# EAGLE design preamp (EAGLE 6.1)
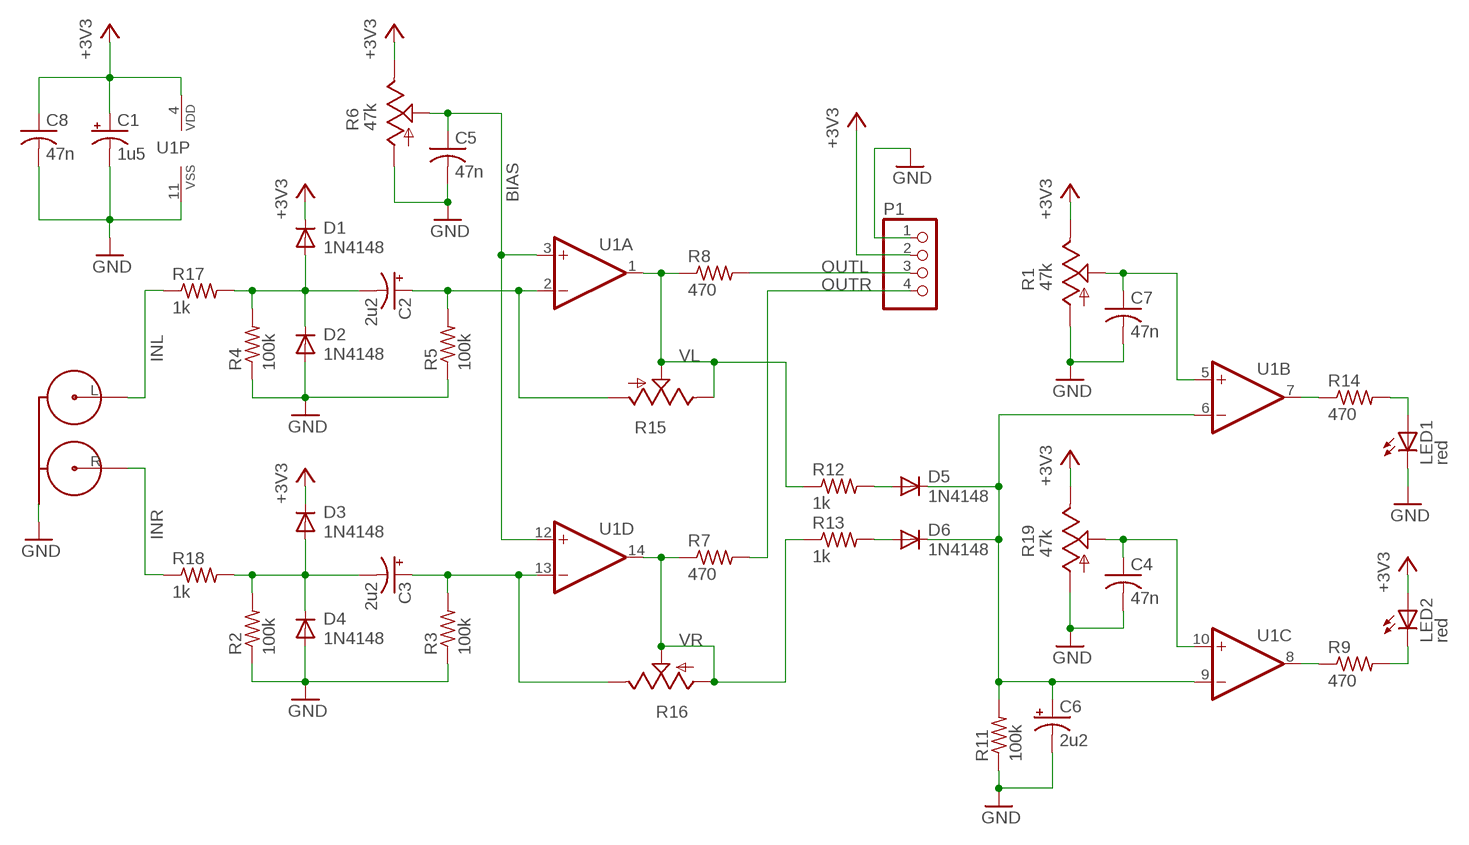
[diagram p0: schematic, sheet 1]

## Parts
C1  1u5  CPOL-USE2-4  [E2-4]
C2  2u2  CPOL-USE2.5-5  [E2,5-5]
C3  2u2  CPOL-USE2.5-5  [E2,5-5]
C4  47n  C-US050-025X075  [C050-025X075]
C5  47n  C-US050-025X075  [C050-025X075]
C6  2u2  CPOL-USE2.5-6  [E2,5-6]
C7  47n  C-US050-025X075  [C050-025X075]
C8  47n  C-US050-025X075  [C050-025X075]
D1  1N4148  [DO35-5]
D2  1N4148  [DO35-5]
D3  1N4148  [DO35-5]
D4  1N4148  [DO35-5]
D5  1N4148  [DO35-5]
D6  1N4148  [DO35-5]
LED1  red  LED3MM  [LED3MM]
LED2  red  LED3MM  [LED3MM]
P1  PINHD-1X4  [1X04]
R1  47k  TRIM_US-PT-10S  [PT-10S]
R2  100k  R-US_0204/5  [0204/5]
R3  100k  R-US_0204/5  [0204/5]
R4  100k  R-US_0204/5  [0204/5]
R5  100k  R-US_0204/5  [0204/5]
R6  47k  TRIM_US-PT-10S  [PT-10S]
R7  470  R-US_0204/5  [0204/5]
R8  470  R-US_0204/5  [0204/5]
R9  470  R-US_0204/5  [0204/5]
R11  100k  R-US_0204/5  [0204/5]
R12  1k  R-US_0204/5  [0204/5]
R13  1k  R-US_0204/5  [0204/5]
R14  470  R-US_0204/5  [0204/5]
R15  TRIM_US-S63S  [S63S]
R16  TRIM_US-S63S  [S63S]
R17  1k  R-US_0204/5  [0204/5]
R18  1k  R-US_0204/5  [0204/5]
R19  47k  TRIM_US-PT-10S  [PT-10S]
RCA1  RCA-2V  [RCA-2V]
U1  MCP6024-I/P  [DIL14]

## Nets
+3V3: C1.+ C8.1 D1.C D3.C LED2.A P1.2 R1.E R6.E R19.E U1.4(P:VDD)
BIAS: C5.1 R6.S U1.3(A:+IN) U1.12(D:+IN)
GND: C1.- C4.2 C5.2 C6.- C7.2 C8.2 D2.A D4.A LED1.K(C) P1.1 R1.A R2.1 R3.1 R4.1 R5.1 R6.A R11.1 R19.A RCA1.SHIELD U1.11(P:VSS)
INL: R17.1 RCA1.L
INR: R18.1 RCA1.R
N$1: C4.1 R19.S U1.10(C:+IN)
N$2: R9.1 U1.8(C:OUT)
N$3: C3.- D3.A D4.C R2.2 R18.2
N$4: C6.+ D5.C D6.C R11.2 U1.6(B:-IN) U1.9(C:-IN)
N$5: C2.+ R5.2 R15.A U1.2(A:-IN)
N$6: C7.1 R1.S U1.5(B:+IN)
N$7: LED1.A R14.2
N$8: C2.- D1.A D2.C R4.2 R17.2
N$9: C3.+ R3.2 R16.E U1.13(D:-IN)
N$10: D5.A R12.2
N$11: D6.A R13.2
N$12: LED2.K(C) R9.2
N$13: R14.1 U1.7(B:OUT)
OUTL: P1.3 R8.2
OUTR: P1.4 R7.2
VL: R8.1 R12.1 R15.E R15.S U1.1(A:OUT)
VR: R7.1 R13.1 R16.A R16.S U1.14(D:OUT)

## Library data of the parts
C1-C3 C6 = rcl:CPOL-US: POLARIZED CAPACITOR, American symbol
C4 C5 C7 C8 = rcl:C-US: CAPACITOR, American symbol
D1-D6 = diode_local:1N4148
LED1 LED2 = led:LED: LED OSRAM: - CHIPLED LG R971, LG N971, LY N971, LG Q971, LY Q971, LO R971, LY R971 LH N974, LH R974 LS Q976, LO Q976, LY Q976 LO Q996 - Hyper CHIPLED LW Q18S LB Q993, LB Q99A, LB R99A - SideLED LS A670, LO A670, LY A670, LG A670, LP A670 LB A673, LV A673, LT A673, LW A673 LH A674 LY A675 LS A676, LA A676, LO A676, LY A676, LW A676 LS A679, LY A679, LG A679 - Hyper Micro SIDELED® LS Y876, LA Y876, LO Y876, LY Y876 LT Y87S - SmartLED LW L88C, LW L88S LB L89C, LB L89S, LG L890 LS L89K, LO L89K, LY L89K LS L896, LA L896, LO L896, LY L896 - TOPLED LS T670, LO T670, LY T670, LG T670, LP T670 LSG T670, LSP T670, LSY T670, LOP T670, LYG T670 LG T671, LOG T671, LSG T671 LB T673, LV T673, LT T673, LW T673 LH T674 LS T676, LA T676, LO T676, LY T676, LB T676, LH T676, LSB T676, LW T676 LB T67C, LV T67C, LT T67C, LS T67K, LO T67K, LY T67K, LW E67C LS E67B, LA E67B, LO E67B, LY E67B, LB E67C, LV E67C, LT E67C LW T67C LS T679, LY T679, LG T679 LS T770, LO T770, LY T770, LG T770, LP T770 LB T773, LV T773, LT T773, LW T773 LH T774 LS E675, LA E675, LY E675, LS T675 LS T776, LA T776, LO T776, LY T776, LB T776 LHGB T686 LT T68C, LB T68C - Hyper Mini TOPLED® LB M676 - Mini TOPLED Santana® LG M470 LS M47K, LO M47K, LY M47K Source: http://www.osram.convergy.de LUXEON: - LUMILED® LXK2-PW12-R00, LXK2-PW12-S00, LXK2-PW14-U00, LXK2-PW14-V00 LXK2-PM12-R00, LXK2-PM12-S00, LXK2-PM14-U00 LXK2-PE12-Q00, LXK2-PE12-R00, LXK2-PE12-S00, LXK2-PE14-T00, LXK2-PE14-U00 LXK2-PB12-K00, LXK2-PB12-L00, LXK2-PB12-M00, LXK2-PB14-N00, LXK2-PB14-P00, LXK2-PB14-Q00 LXK2-PR12-L00, LXK2-PR12-M00, LXK2-PR14-Q00, LXK2-PR14-R00 LXK2-PD12-Q00, LXK2-PD12-R00, LXK2-PD12-S00 LXK2-PH12-R00, LXK2-PH12-S00 LXK2-PL12-P00, LXK2-PL12-Q00, LXK2-PL12-R00 Source: www.luxeon.com KINGBRIGHT: KA-3528ASYC Source: www.kingbright.com
P1 = pinhead:PINHD-1X4: PIN HEADER
R1 R6 R15 R16 R19 = pot:TRIM_US-: POTENTIOMETER
R2-R5 R7-R9 R11-R14 R17 R18 = rcl:R-US_: RESISTOR, American symbol
RCA1 = con_local:RCA-2V
U1 = microchip_local:MCP6024

## Board
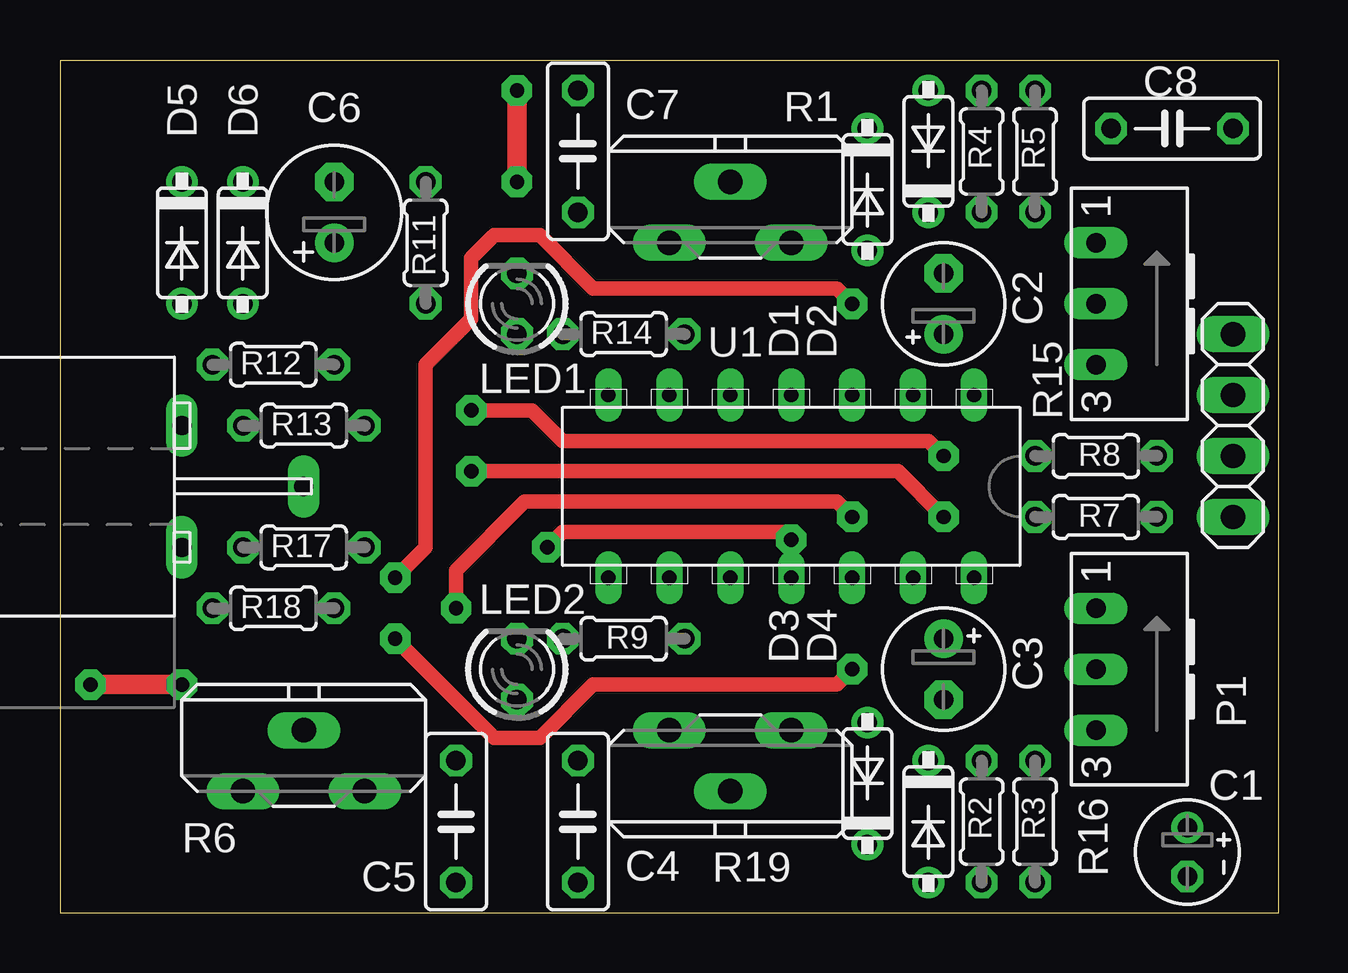
[diagram p1: board, top side]
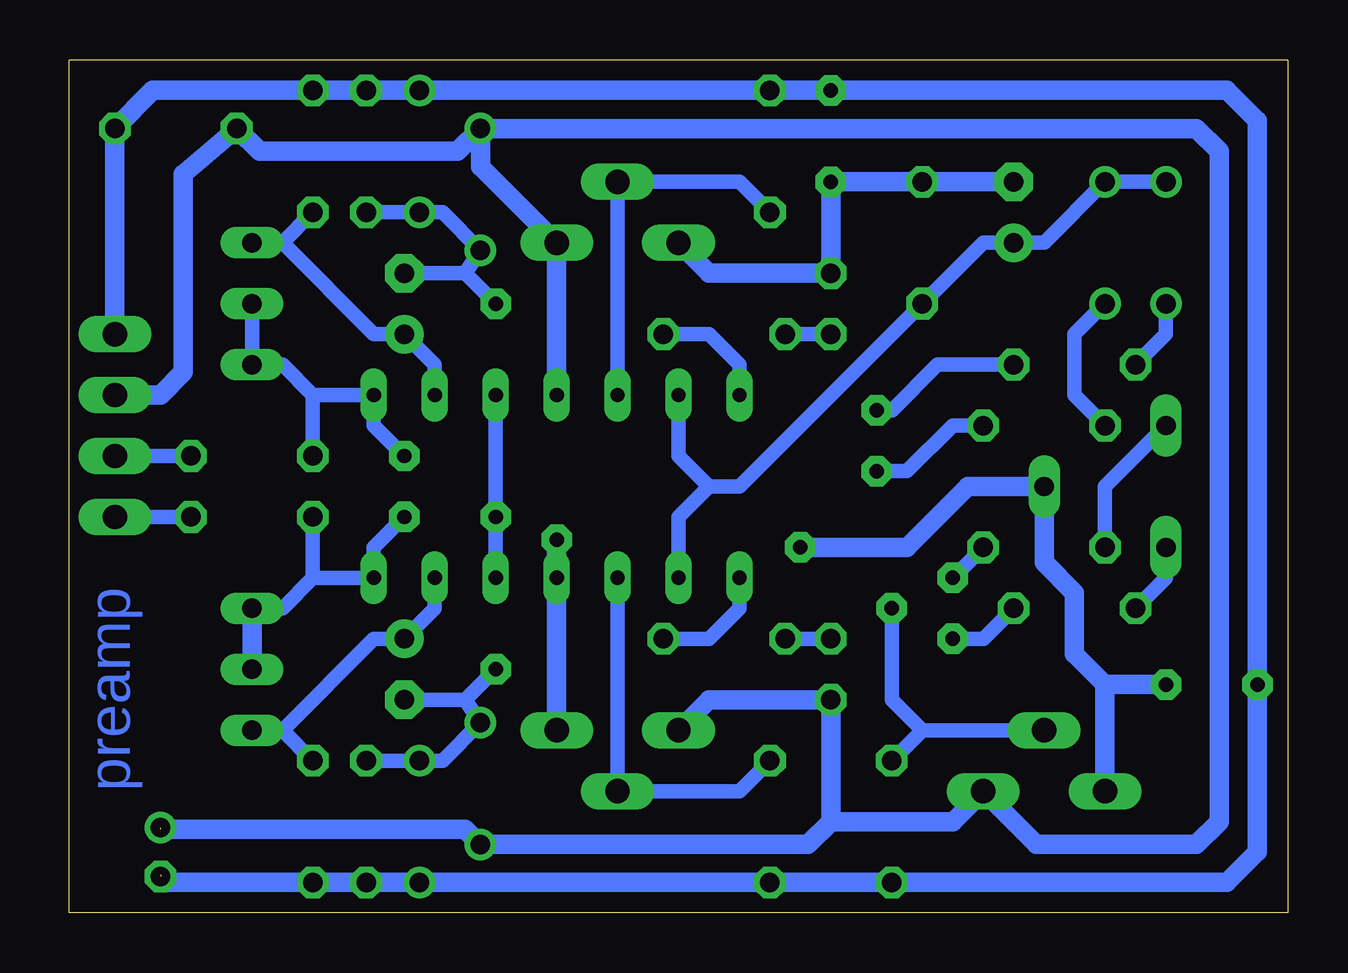
[diagram p2: board, bottom side, seen from below]

Size 50.8 x 35.56 mm. Coordinates in mm from the lower left corner, seen from the top.
Outline: 0,0 50.8,0 50.8,35.56 0,35.56 0,0
Copper layers (1*16): Top 0.035mm / dielectric 1.5mm / Bottom 0.035mm
Design rules: minimum track width 16mil, minimum drill 10mil, track to track 16mil, track to pad 16mil, pad to pad 16mil, via to via 16mil, smd to smd 16mil, copper to edge 10mil, drill to drill 8mil, minimum pad ring 10mil, minimum via ring 8mil, stop-mask expansion 4mil, vias tented up to drill 0mil, thermal gap 10mil

### Footprints (pad centres in the part's own frame; a part is rotated, then mirrored left to right if it is on the bottom)
E2-4 = drill 0.813 pad 1.27: + -1.016,0 | drill 0.813 pad 1.27 octagon: - 1.016,0
E2,5-5 = drill 0.813 pad 1.6: + -1.27,0 | drill 0.813 pad 1.6 octagon: - 1.27,0
C050-025X075 = drill 0.813 octagon: 1 -2.54,0; 2 2.54,0
E2,5-6 = drill 0.813 pad 1.6: + -1.27,0 | drill 0.813 pad 1.6 octagon: - 1.27,0
DO35-5 = drill 0.813: A 2.54,0; C -2.54,0
LED3MM = drill 0.813 octagon: A -1.27,0; K 1.27,0
1X04 = drill 1.016 long: 1 -3.81,0; 2 -1.27,0; 3 1.27,0; 4 3.81,0
PT-10S = drill 1.016 long: A -2.54,-1.27; E 2.54,-1.27; S 0,1.27
0204/5 = drill 0.813 octagon: 1 -2.54,0; 2 2.54,0
S63S = drill 0.813 long: A 2.54,1.27; E -2.54,1.27; S 0,1.27
RCA-2V = drill 0.8 long: L -2.54,-2.54; R 2.54,-2.54; SHIELD 0,2.54
DIL14 = drill 0.6 pad 1.016 long: 1 -3.81,7.62; 2 -3.81,5.08; 3 -3.81,2.54; 4 -3.81,0; 5 -3.81,-2.54; 6 -3.81,-5.08; 7 -3.81,-7.62; 8 3.81,-7.62; 9 3.81,-5.08; 10 3.81,-2.54; 11 3.81,0; 12 3.81,2.54; 13 3.81,5.08; 14 3.81,7.62

### Placement (x,y rotation side)
C1  46.99,2.54 270 top
C2  36.83,25.4 90 top
C3  36.83,10.16 270 top
C4  21.59,3.81 270 top
C5  16.51,3.81 270 top
C6  11.43,29.21 90 top
C7  21.59,31.75 90 top
C8  46.35,32.7 0 top
D1  33.65,30.16 270 top
D2  36.2,31.75 90 top
D3  33.65,5.4 90 top
D4  36.2,3.81 270 top
D5  5.08,27.94 270 top
D6  7.62,27.94 270 top
LED1  19.05,25.4 90 top
LED2  19.05,10.16 90 top
P1  48.89,20.32 270 top
R1  27.94,29.21 0 top
R2  38.42,3.81 90 top
R3  40.64,3.81 90 top
R4  38.42,31.75 270 top
R5  40.64,31.75 270 top
R6  10.16,6.35 0 top
R7  43.18,16.51 0 top
R8  43.18,19.05 0 top
R9  23.5,11.43 180 top
R11  15.24,27.94 270 top
R12  8.89,22.86 180 top
R13  10.16,20.32 180 top
R14  23.5,24.13 180 top
R15  44.45,25.4 90 top
R16  44.45,10.16 90 top
R17  10.16,15.24 0 top
R18  8.89,12.7 0 top
R19  27.94,6.35 180 top
RCA1  7.62,17.78 270 top
U1  30.48,17.78 270 top

### Tracks (layer width: path | path; a pad name or v marks a point on that pad's centre or on a via)
+3V3  (1 unrouted)
  Bottom 0.813: P1.2 46.99,21.59 46.04,22.54 46.04,30.8 C8.1 42.86,31.75 34.61,31.75 D1.C | D1.C 3.81,32.7 2.86,31.75 2.86,3.81 3.81,2.86 10.48,2.86 R6.E 13.97,3.81 19.05,3.81 | 46.99,3.49 34.29,3.49 D3.C 20,2.86 19.05,3.81 | D1.C 33.65,31.12 R1.E U1.4 | R19.E 24.13,8.89 LED2.A 19.05,3.81
BIAS  (via drill 0.6 pad 1.27)
  Top 0.61: v33.02,16.51 32.38,17.15 19.37,17.15 16.51,14.29 v16.51,12.7
  Bottom 0.61: U1.3 v33.02,16.51 U1.12 | C5.1 15.24,7.62 | 15.24,7.62 R6.S | 15.24,7.62 16.51,8.89 v16.51,12.7
GND  (via drill 0.6 pad 1.27)  (1 unrouted)
  Top 0.61: v30.48,15.56 30.16,15.87 20.96,15.87 v20.32,15.24
  Top 0.813: v19.05,34.29 v19.05,30.48 | v5.08,9.53 v1.27,9.53
  Bottom 0.813: P1.1 C8.2 47.31,34.29 R5.1 R4.1 D2.A C7.2 v19.05,34.29 2.54,34.29 1.27,33.02 v1.27,9.53 1.27,2.54 2.54,1.27 C5.2 C4.2 D4.A R2.1 R3.1 46.67,1.27 46.99,1.59 | 7.62,9.53 8.89,10.79 8.89,13.33 10.16,14.6 RCA1.SHIELD 13.34,17.78 15.88,15.24 v20.32,15.24 | 7.62,9.53 v5.08,9.53 | v30.48,15.56 U1.11 R19.A | 7.62,9.53 R6.A | C6.- R11.1 v19.05,30.48 LED1.K 24.13,26.67 R1.A
INL
  Bottom 0.61: R17.1 7.62,17.78 RCA1.L
INR
  Bottom 0.61: R18.1 5.08,13.97 RCA1.R
N$1
  Bottom 0.61: C4.1 22.86,5.08 R19.S U1.10
N$2
  Bottom 0.61: R9.1 24.13,11.43 22.86,12.7 U1.8
N$3  (via drill 0.6 pad 1.27)
  Top 0.61: v33.02,10.16 32.38,9.53 22.23,9.53 20,7.3 18.1,7.3 v13.97,11.43
  Bottom 0.61: R2.2 D4.C 35.24,6.35 D3.A 34.29,8.89 | R18.2 12.7,11.43 v13.97,11.43 | v33.02,10.16 33.65,9.53 34.29,8.89 | C3.- 34.29,8.89
N$4
  Bottom 0.61: D5.C D6.C 10.16,27.94 C6.+ 12.7,27.94 R11.2 22.86,17.78 24.13,17.78 | 24.13,17.78 25.4,19.05 U1.6 | U1.9 25.4,16.51 24.13,17.78
N$5
  Bottom 0.61: R15.A 41.91,27.94 | 41.91,27.94 R5.2 | 41.91,27.94 38.1,24.13 C2.+ 35.56,22.86 U1.2
N$6
  Bottom 0.61: U1.5 R1.S 22.86,30.48 C7.1
N$7
  Bottom 0.61: LED1.A R14.2
N$8  (via drill 0.6 pad 1.27)
  Top 0.61: v33.02,25.4 32.38,26.03 22.23,26.03 20,28.26 18.1,28.26 17.14,27.3 17.14,24.77 15.24,22.86 15.24,15.24 v13.97,13.97
  Bottom 0.61: R4.2 D2.C 35.24,29.21 D1.A 34.29,26.67 | 34.29,26.67 33.65,26.03 v33.02,25.4 | v13.97,13.97 R17.2 | C2.- 34.29,26.67
N$9
  Bottom 0.61: U1.13 35.56,12.7 C3.+ 38.1,11.43 41.91,7.62 | 41.91,7.62 R16.E | R3.2 41.91,7.62
N$10
  Bottom 0.61: R12.2 5.08,24.13 D5.A
N$11
  Bottom 0.61: R13.2 8.89,21.59 8.89,24.13 D6.A
N$12
  Bottom 0.61: LED2.K R9.2
N$13
  Bottom 0.61: R14.1 24.13,24.13 22.86,22.86 U1.7
OUTL
  Bottom 0.61: R8.2 P1.3
OUTR
  Bottom 0.61: R7.2 P1.4
VL  (via drill 0.6 pad 1.27)
  Top 0.61: v36.83,19.05 36.2,19.69 20.96,19.69 19.68,20.95 v17.14,20.95
  Bottom 0.61: R15.S R15.E 41.91,22.86 40.64,21.59 | 40.64,21.59 R8.1 | 40.64,21.59 U1.1 38.1,20.32 v36.83,19.05 | v17.14,20.95 16.51,20.95 14.61,22.86 R12.1
VR  (via drill 0.6 pad 1.27)
  Top 0.61: v36.83,16.51 34.92,18.41 v17.14,18.41
  Bottom 0.61: 40.64,13.97 U1.14 38.1,15.24 v36.83,16.51 | R7.1 40.64,13.97 | R16.A 41.91,12.7 40.64,13.97 | v17.14,18.41 15.88,18.41 13.97,20.32 R13.1
  Bottom 0.813: R16.A R16.S

### Text on the board
Bottom: preamp
tDocu: G | P | A | B